# EAGLE design blinker (EAGLE 7.5.0)
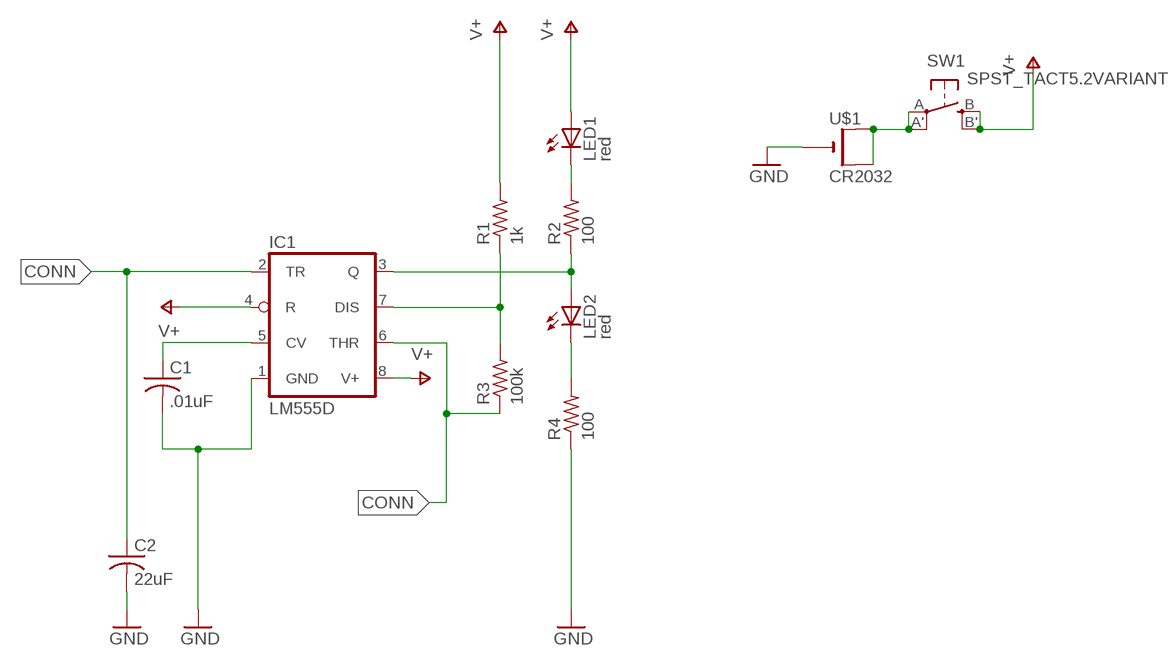
[diagram p0: schematic, sheet 1]

## Parts
C1  .01uF  C-USC0805  [C0805]
C2  22uF  C-USC0805  [C0805]
IC1  LM555D  [SO08]
LED1  red  LEDCHIPLED_0805  [CHIPLED_0805]
LED2  red  LEDCHIPLED_0805  [CHIPLED_0805]
R1  1k  R-US_R0805  [R0805]
R2  100  R-US_R0805  [R0805]
R3  100k  R-US_R0805  [R0805]
R4  100  R-US_R0805  [R0805]
SW1  SPST_TACT5.2VARIANT  [5.2X5.2]
U$1  CR2032  CR2032SMT  [CR2032-SMD]

## Nets
CONN: C2.1 IC1.2(TR) IC1.6(THR) R3.1
GND: C1.2 C2.2 IC1.1(GND) R4.1 U$1.-
N$1: LED1.C R2.2
N$2: IC1.3(Q) LED2.A R2.1
N$3: LED2.C R4.2
N$4: IC1.7(DIS) R1.1 R3.2
N$5: C1.1 IC1.5(CV)
N$6: SW1.A'(P1) SW1.A(P) U$1.+$1(+) U$1.+$2(+1)
V+: IC1.4(R) IC1.8(V+) LED1.A R1.2 SW1.B'(S1) SW1.B(S)

## Library data of the parts
C1 C2 = adafruit:C-US: CAPACITOR, American symbol
IC1 = adafruit:*555: TIMER Changed DIP package to have round (not oval) pin pads http://www.ladyada.net/library/pcb/eaglelibrary.html
LED1 LED2 = adafruit:LED: LED OSRAM: - CHIPLED LG R971, LG N971, LY N971, LG Q971, LY Q971, LO R971, LY R971 LH N974, LH R974 LS Q976, LO Q976, LY Q976 LO Q996 - Hyper CHIPLED LW Q18S LB Q993, LB Q99A, LB R99A - SideLED LS A670, LO A670, LY A670, LG A670, LP A670 LB A673, LV A673, LT A673, LW A673 LH A674 LY A675 LS A676, LA A676, LO A676, LY A676, LW A676 LS A679, LY A679, LG A679 - Hyper Micro SIDELED® LS Y876, LA Y876, LO Y876, LY Y876 LT Y87S - SmartLED LW L88C, LW L88S LB L89C, LB L89S, LG L890 LS L89K, LO L89K, LY L89K LS L896, LA L896, LO L896, LY L896 - TOPLED LS T670, LO T670, LY T670, LG T670, LP T670 LSG T670, LSP T670, LSY T670, LOP T670, LYG T670 LG T671, LOG T671, LSG T671 LB T673, LV T673, LT T673, LW T673 LH T674 LS T676, LA T676, LO T676, LY T676, LB T676, LH T676, LSB T676, LW T676 LB T67C, LV T67C, LT T67C, LS T67K, LO T67K, LY T67K, LW E67C LS E67B, LA E67B, LO E67B, LY E67B, LB E67C, LV E67C, LT E67C LW T67C LS T679, LY T679, LG T679 LS T770, LO T770, LY T770, LG T770, LP T770 LB T773, LV T773, LT T773, LW T773 LH T774 LS E675, LA E675, LY E675, LS T675 LS T776, LA T776, LO T776, LY T776, LB T776 LHGB T686 LT T68C, LB T68C - Hyper Mini TOPLED® LB M676 - Mini TOPLED Santana® LG M470 LS M47K, LO M47K, LY M47K Source: http://www.osram.convergy.de/
R1-R4 = adafruit:R-US_: RESISTOR, American symbol
SW1 = mokerek:SPST_TACT: SPST Tactile Switch Single Pole Single Throw Button. Available layouts: 5.2x5.2mm Originally came from Adafruit's SPST_TACT and was modified as the source was for a 6x6mm tactile. For datasheets, see: Dongnan TS45 <https://github.com/mokerek/mokolas/blob/master/datasheets/tactile-switches/5.2x5.2x1.5-dongnan.pdf> ALPS SKQG Series <https://github.com/mokerek/mokolas/blob/master/datasheets/tactile-switches/5.2x5.2x1.5.pdf>
U$1 = mokerek:CR2032

## Net classes
0 default: width 0.305 mm, drill 0.508 mm, clearance 0.254 mm

## Board
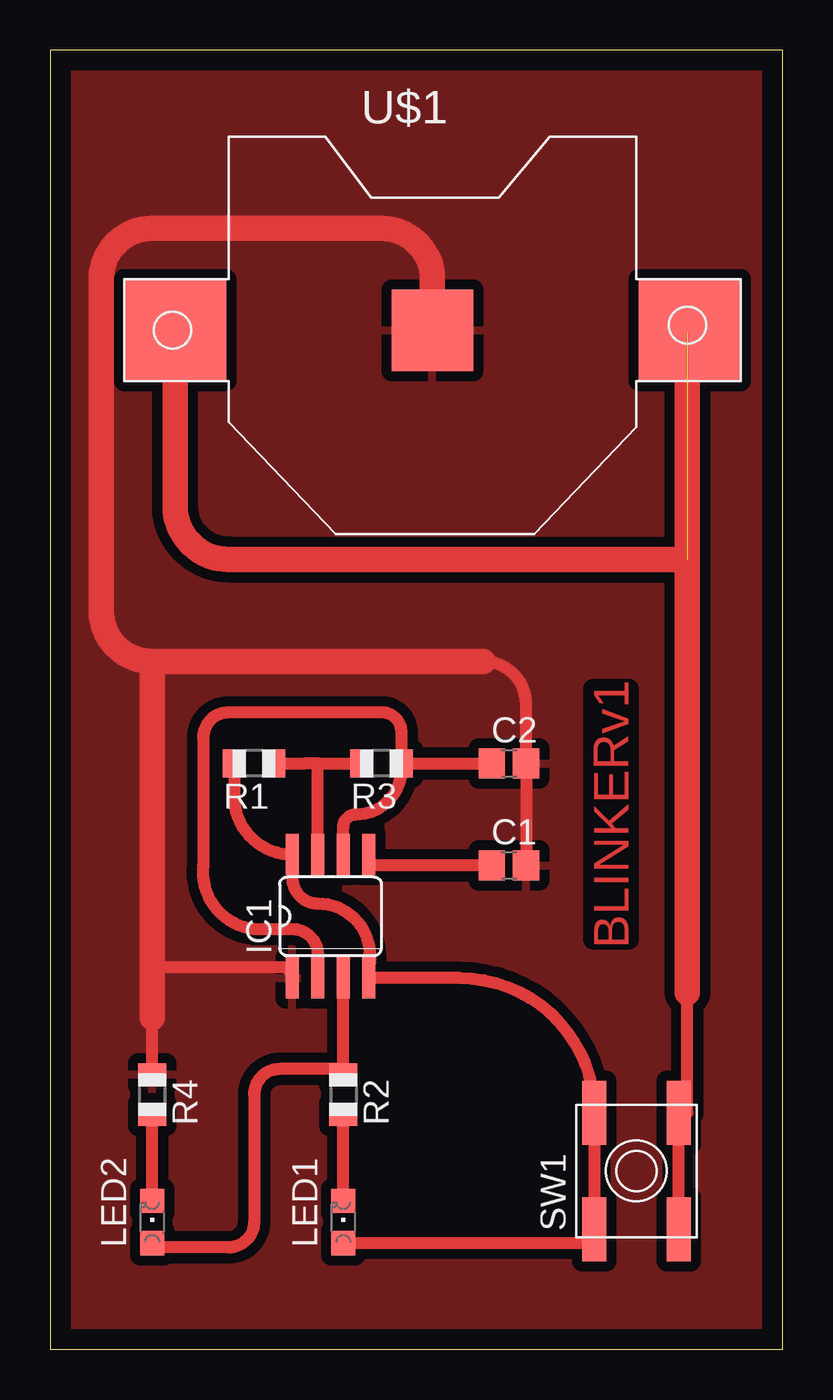
[diagram p1: board, top side]

Size 36.5 x 64.76 mm. Coordinates in mm from the lower left corner, seen from the top.
Outline: 0,0 36.5,0 36.5,64.76 0,64.76 0,0
Copper layers (1*16): Top 0.035mm / dielectric 1.5mm / Bottom 0.035mm
Design rules "default *": minimum track width 10mil, minimum drill 24mil, track to track 20mil, track to pad 20mil, pad to pad 20mil, via to via 20mil, smd to smd 20mil, copper to edge 40mil, drill to drill 8mil, minimum pad ring 10mil, minimum via ring 8mil, stop-mask expansion 4mil, vias tented up to drill 0mil, thermal gap 20mil

### Footprints (pad centres in the part's own frame; a part is rotated, then mirrored left to right if it is on the bottom)
C0805 = smd 1.3 x 1.5: 1 -0.85,0; 2 0.85,0
SO08 = smd 0.66 x 2.032: 1 -1.905,-3.073; 2 -0.635,-3.073; 3 0.635,-3.073; 4 1.905,-3.073; 5 1.905,3.073; 6 0.635,3.073; 7 -0.635,3.073; 8 -1.905,3.073
CHIPLED_0805 = smd 1.2 x 1.2: A 0,-1.05; C 0,1.05
R0805 = smd 1.1 x 1.4: 1 -1,0; 2 1,0
5.2X5.2 = smd 3.2 x 1.2: A -2.9,-2.104; A' 2.9,-2.104; B -2.9,2.104; B' 2.9,2.104
CR2032-SMD = smd 5.08 x 5.08: +$1 -12.827,0; +$2 12.827,0 | smd 4.064 x 4.064: - 0,0

### Placement (x,y rotation side)
C1  22.86,24.13 0 top
C2  22.86,29.21 0 top
IC1  13.97,21.59 0 top
LED1  14.61,6.35 0 top
LED2  5.08,6.35 0 top
R1  10.16,29.21 180 top
R2  14.61,12.7 270 top
R3  16.51,29.21 180 top
R4  5.08,12.7 270 top
SW1  29.21,8.89 90 top
U$1  19.05,50.8 0 top

### Tracks (layer width: path | path; a pad name or v marks a point on that pad's centre or on a via)
CONN
  Top 0.61: IC1.6 14.61,26.04 arc-90 15.24,26.67 arc90 17.51,28.94 R3.1 | R3.1 C2.1 | R3.1 17.51,30.75 arc90 16.51,31.75 8.89,31.75 arc90 7.62,30.48 7.62,24.13 arc90 10.16,20.95 12.06,20.95 arc-90 13.34,19.68 IC1.2
GND
  Top 0.61: C1.2 C2.2 23.71,32.17 arc90 21.59,34.29 | R4.1 5.08,16.51 | IC1.1 arc90 11.53,19.05 5.08,19.05
  Top 1.27: 21.59,34.29 5.08,34.29 | 5.08,34.29 5.08,19.05 5.08,16.51 | U$1.- 19.05,53.34 arc90 16.51,55.88 5.08,55.88 arc90 2.54,53.34 2.54,36.83 arc90 5.08,34.29
  pour Top: -1.27,66.04 -1.27,-1.27 38.1,-1.27 38.1,66.04
N$1
  Top 0.61: LED1.C R2.2
N$2
  Top 0.61: IC1.3 R2.1 14.34,13.97 11.43,13.97 arc90 10.16,12.7 10.16,6.35 arc-90 8.89,5.08 5.3,5.08 arc-90 LED2.A
N$3
  Top 0.61: LED2.C R4.2
N$4
  Top 0.61: R1.1 12.7,29.21 13.34,29.21 | 13.34,29.21 R3.2 | IC1.7 13.34,29.21
N$5
  Top 0.61: C1.1 15.88,24.13 IC1.5
N$6  (1 unrouted)
  Top 0.61: SW1.A SW1.A' 31.75,11.79 31.75,17.78
  Top 1.27: 31.75,39.37 8.89,39.37 arc-90 6.22,42.04 U$1.+$1 | U$1.+$2 arc90 31.75,50.67 31.75,17.78
V+
  Top 0.61: R1.2 9.16,27.57 arc90 IC1.8 12.06,23.5 arc90 13.34,22.23 arc-103 15.88,19.05 | 15.88,19.68 15.88,19.05 | 15.88,19.05 IC1.4 20.38,18.52 arc-90 SW1.B' SW1.B | 27.11,4.93 SW1.B | LED1.A 27.11,5.3 SW1.B

### Text on the board
Top: BLINKERv1